# Altium schematic sheet MR_RangeSensor.SchDoc
size A4; CompanyName: BeeIonic; SheetNumber: 6; SheetTotal: 7
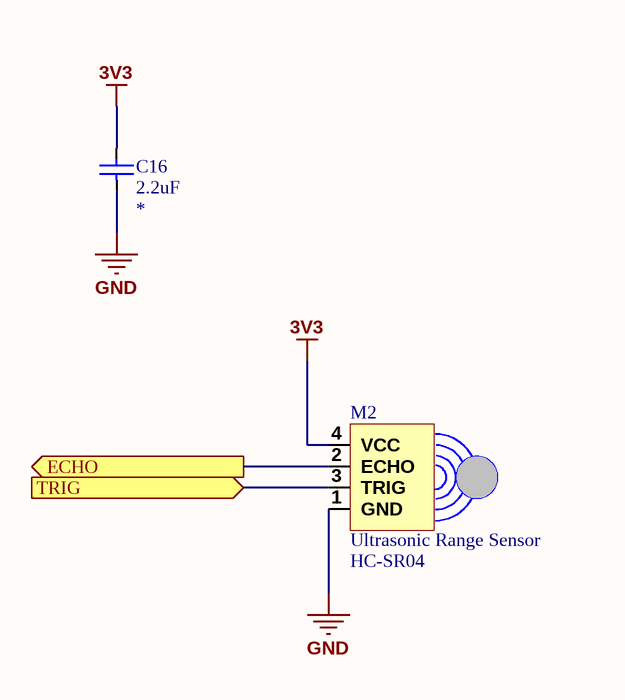
[diagram p0: MR_RangeSensor.SchDoc]

## Parts
C16  value 2.2uF  [0603_CAP_LD]  (hidden comment: CerCap)
M2  Ultrasonic Range Sensor  [HC-SR04]

## Ports
ECHO (out), TRIG (in)

## Nets
3V3: C16.2 M2.4(VCC)
GND: C16.1 M2.1(GND)
ECHO: M2.2(ECHO) ; port ECHO
TRIG: M2.3(TRIG) ; port TRIG

## Notes on the sheet
- Project :
- Title :
- Sheet:
- of
- Creation Date :
- Designer :
- Modified Date :

## Library data of the parts
C16 = CerCap: Ceramic Capacitor; Type: *; Voltage/Power: *; Package: *
M2 = HC-SR04: Reference: HC-SR04